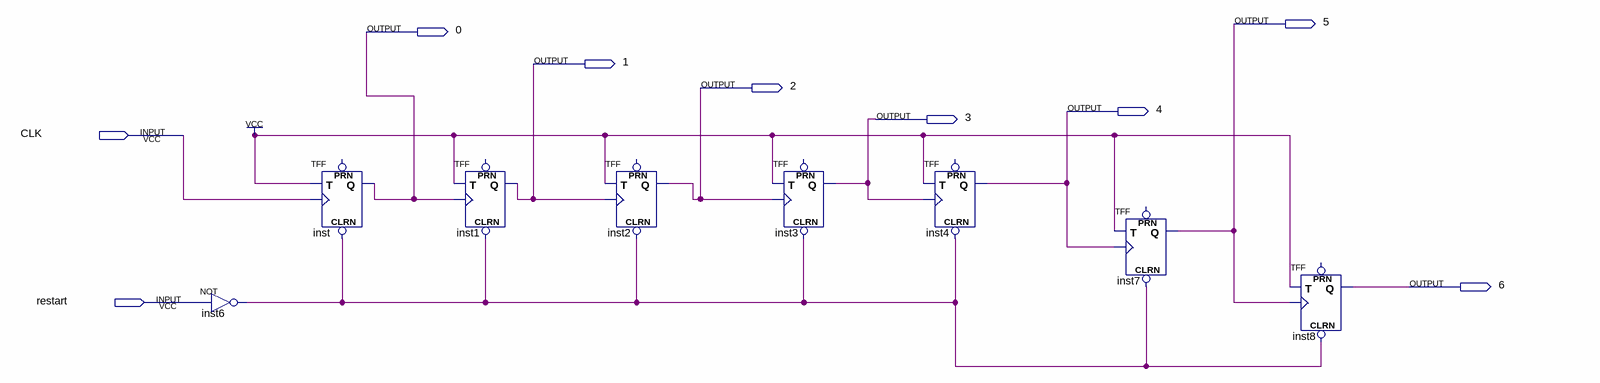
[diagram p0: schematic sheet]
// Quartus schematic count7bits.bdf as structural Verilog: 8 symbols, 9 pins
module count7bits (
  input  CLK,
  input  restart,
  output \5 ,
  output \0 ,
  output \1 ,
  output \2 ,
  output \4 ,
  output \3 ,
  output \6 
);

  wire inst6_out;

  not inst6 (inst6_out, restart);
  TFF inst (.CLRN(inst6_out), .T(1'b1), .CLK(CLK), .Q(\0 ));  // open: PRN
  TFF inst1 (.CLRN(inst6_out), .T(1'b1), .CLK(\0 ), .Q(\1 ));  // open: PRN
  TFF inst2 (.CLRN(inst6_out), .T(1'b1), .CLK(\1 ), .Q(\2 ));  // open: PRN
  TFF inst3 (.CLRN(inst6_out), .T(1'b1), .CLK(\2 ), .Q(\3 ));  // open: PRN
  TFF inst4 (.CLRN(inst6_out), .T(1'b1), .CLK(\3 ), .Q(\4 ));  // open: PRN
  TFF inst7 (.CLRN(inst6_out), .T(1'b1), .CLK(\4 ), .Q(\5 ));  // open: PRN
  TFF inst8 (.CLRN(inst6_out), .T(1'b1), .CLK(\5 ), .Q(\6 ));  // open: PRN
endmodule
